# EAGLE schematic Meishino_v11 (EAGLE 9.1.0)
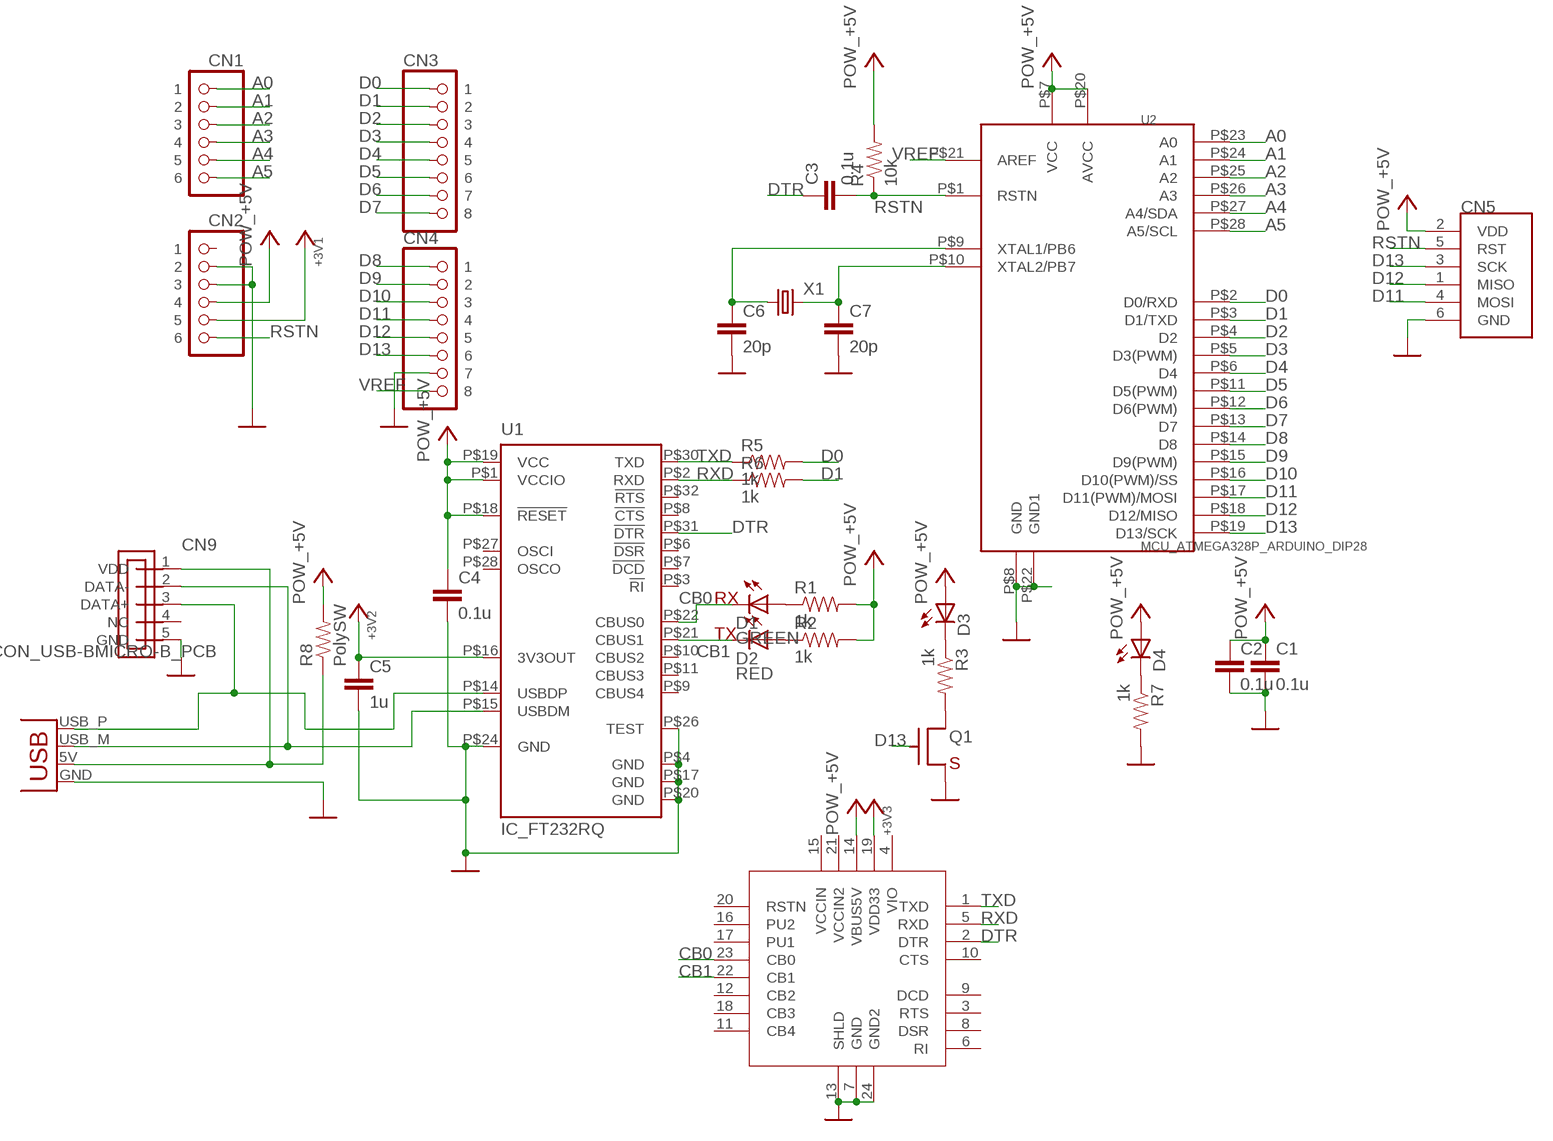
[diagram p0: schematic, sheet 1]

## Parts
C1  0.1u  CAPTH_5MML  [CAP_TH_5MM_L]
C2  0.1u  CAPTH_5MML  [CAP_TH_5MM_L]
C3  0.1u  CAPTH_5MML  [CAP_TH_5MM_L]
C4  0.1u  CAPTH_5MML  [CAP_TH_5MM_L]
C5  1u  CAPTH_5MML  [CAP_TH_5MM_L]
C6  20p  CAPTH_5MML  [CAP_TH_5MM_L]
C7  20p  CAPTH_5MML  [CAP_TH_5MM_L]
CN1  CON_PINHD-1X6  [1X06]
CN2  CON_PINHD-1X6  [1X06]
CN3  CON_PINHD-1X8  [1X08]
CN4  CON_PINHD-1X8  [1X08]
CN5  CON_AVRISPTH  [2X03R]
CN9  CON_USB-BMICRO-B_PCB  [USB-MICRO-PCB]
D1  GREEN  LED5MM  [SPARKFUN_LED5MM]
D2  RED  LED5MM  [SPARKFUN_LED5MM]
D3  LED5MM  [SPARKFUN_LED5MM]
D4  LED5MM  [SPARKFUN_LED5MM]
JP2  CON_USBPCB  [USB-A-PCB]
Q1  TR_NMOS_2N7000  [TO-92]
R1  1k  RESTH_10MML  [R_TH_10MM_L]
R2  1k  RESTH_10MML  [R_TH_10MM_L]
R3  1k  RESTH_10MML  [R_TH_10MM_L]
R4  10k  RESTH_10MML  [R_TH_10MM_L]
R5  1k  RESTH_10MML  [R_TH_10MM_L]
R6  1k  RESTH_10MML  [R_TH_10MM_L]
R7  1k  RESTH_10MML  [R_TH_10MM_L]
R8  PolySW  RESTH_10MML  [R_TH_10MM_L]
U1  IC_FT232RQ  [QFN32]
U2  MCU_ATMEGA328P_ARDUINO_DIP28  [DIP-28P(300MIL)]
U3  MOD_AE_FT232_DIP24  [DIP24_600MIL]
X1  XTAL2HC49US  [HC49US]

## Nets
+3V3: C5.1 CN2.5 U1.P$16(3V3OUT) U3.19(VDD33) ; supply symbol labelled POW_+3V3
+5V: C1.1 C2.1 C4.1 CN2.4 CN5.2(VDD) D3.A D4.A R1.2 R2.2 R4.2 R8.2 U1.P$1(VCCIO) U1.P$18(!RESET) U1.P$19(VCC) U2.P$7(VCC) U2.P$20(AVCC) U3.14(VBUS5V) ; supply symbol labelled POW_+5V
A0: CN1.1 U2.P$23(A0)
A1: CN1.2 U2.P$24(A1)
A2: CN1.3 U2.P$25(A2)
A3: CN1.4 U2.P$26(A3)
A4: CN1.5 U2.P$27(A4/SDA)
A5: CN1.6 U2.P$28(A5/SCL)
CB0: D1.K(C) U1.P$22(CBUS0) U3.23(CB0)
CB1: D2.K(C) U1.P$21(CBUS1) U3.22(CB1)
D0: CN3.1 R5.2 U2.P$2(D0/RXD)
D1: CN3.2 R6.2 U2.P$3(D1/TXD)
D2: CN3.3 U2.P$4(D2)
D3: CN3.4 U2.P$5(D3(PWM))
D4: CN3.5 U2.P$6(D4)
D5: CN3.6 U2.P$11(D5(PWM))
D6: CN3.7 U2.P$12(D6(PWM))
D7: CN3.8 U2.P$13(D7)
D8: CN4.1 U2.P$14(D8)
D9: CN4.2 U2.P$15(D9(PWM))
D10: CN4.3 U2.P$16(D10(PWM)/SS)
D11: CN4.4 CN5.4(MOSI) U2.P$17(D11(PWM)/MOSI)
D12: CN4.5 CN5.1(MISO) U2.P$18(D12/MISO)
D13: CN4.6 CN5.3(SCK) Q1.2(G) U2.P$19(D13/SCK)
DTR: C3.1 U1.P$31(!DTR) U3.2(DTR)
GND: C1.2 C2.2 C4.2 C5.2 C6.2 C7.2 CN2.2 CN2.3 CN4.7 CN5.6(GND) CN9.5(GND) JP2.GND Q1.1(S) R7.2 U1.P$4(GND) U1.P$17(GND) U1.P$20(GND) U1.P$24(GND) U1.P$26(TEST) U2.P$8(GND) U2.P$22(GND1) U3.7(GND) U3.13(SHLD) U3.24(GND2) ; supply symbol labelled POW_GND
N$1: D1.A R1.1
N$2: D2.A R2.1
N$7: D3.K(C) R3.1
N$9: CN9.3(DATA+) JP2.USB_P(D+) U1.P$14(USBDP)
N$12: CN9.2(DATA-) JP2.USB_M(D-) U1.P$15(USBDM)
N$14: D4.K(C) R7.1
N$15: C6.1 U2.P$9(XTAL1/PB6) X1.1
N$16: C7.1 U2.P$10(XTAL2/PB7) X1.2
N$18: CN9.1(VDD) JP2.5V(VBUS) R8.1
N$19: Q1.3(D) R3.2
RSTN: C3.2 CN2.6 CN5.5(RST) R4.1 U2.P$1(RSTN)
RXD: R6.1 U1.P$2(RXD) U3.5(RXD)
TXD: R5.1 U1.P$30(TXD) U3.1(TXD)
VREF: CN4.8 U2.P$21(AREF)
Unconnected: CN2.1 CN9.4(NC) U1.P$3(!RI) U1.P$6(!DSR) U1.P$7(!DCD) U1.P$8(!CTS) U1.P$9(CBUS4) U1.P$10(CBUS2) U1.P$11(CBUS3) U1.P$27(OSCI) U1.P$28(OSCO) U1.P$32(!RTS) U3.3(RTS) U3.4(VIO) U3.6(RI) U3.8(DSR) U3.9(DCD) U3.10(CTS) U3.11(CB4) U3.12(CB2) U3.15(VCCIN) U3.16(PU2) U3.17(PU1) U3.18(CB3) U3.20(RSTN) U3.21(VCCIN2)

## Notes on the sheet
- RX
- TX

## Library data of the parts
C1-C7 = akita:CAP: Capacitor Standard 0603 ceramic capacitor, and 0.1" leaded capacitor.
CN1 CN2 = akita:CON_PINHD-1X6: PIN HEADER
CN3 CN4 = akita:CON_PINHD-1X8: PIN HEADER
CN5 = akita:CON_AVRISP: AVR ISP standard 2x3 connector
CN9 = akita:CON_USB-B
D1-D4 = akita:LED: LEDs Standard schematic elements and footprints for 5mm, 3mm, 1206, and 0603 sized LEDs. 5mm - Spark Fun Electronics SKU : COM-00529 (and others)
JP2 = akita:CON_USB: USB Connectors USB-B-PTH is fully proven SKU : PRT-00139/CONN-08278 USB-miniB is fully proven SKU : PRT-00587 USB-A-PCB is untested. USB-A-H is throughly reviewed, but untested. Spark Fun Electronics SKU : PRT-00437 USB-B-SMT is throughly reviewed, but untested. Needs silkscreen touching up. USB-A-S has not been used/tested USB-MB-H has not been used/tested USB-MICROB has been used. CONN-09505
Q1 = akita:TR_NMOS_2N7000: 2N7000, nMOS
R1-R8 = akita:RES: Resistor Basic schematic elements and footprints for 0603, 1206, and PTH resistors.
U1 = akita:IC_FT232R: Source: http://www.ftdichip.com/Documents/DataSheets/DS_FT232R_v104.pdf
U2 = akita:MCU_ATMEGA328P_ARDUINO_DIP28: ATmega328P, Arduino's pin assign, DIP28
U3 = akita:MOD_AE_FT232_DIP24: Akizuki's FT232, DIP24
X1 = akita:XTAL2: Crystals Various standard crystals. Proven footprints. Spark Fun Electronics SKU : COM-00534